# EasyEDA Pro project s3.eprj

# Schematic Schematic1
Board Name: Board1; Create Date: 2025-05-26; Page Name: P1; Project Name: s3; Schematic Name: Schematic1; Update Date: 2025-05-26; Company: 嘉立创EDA; Page Size: A4; Version: V1.0
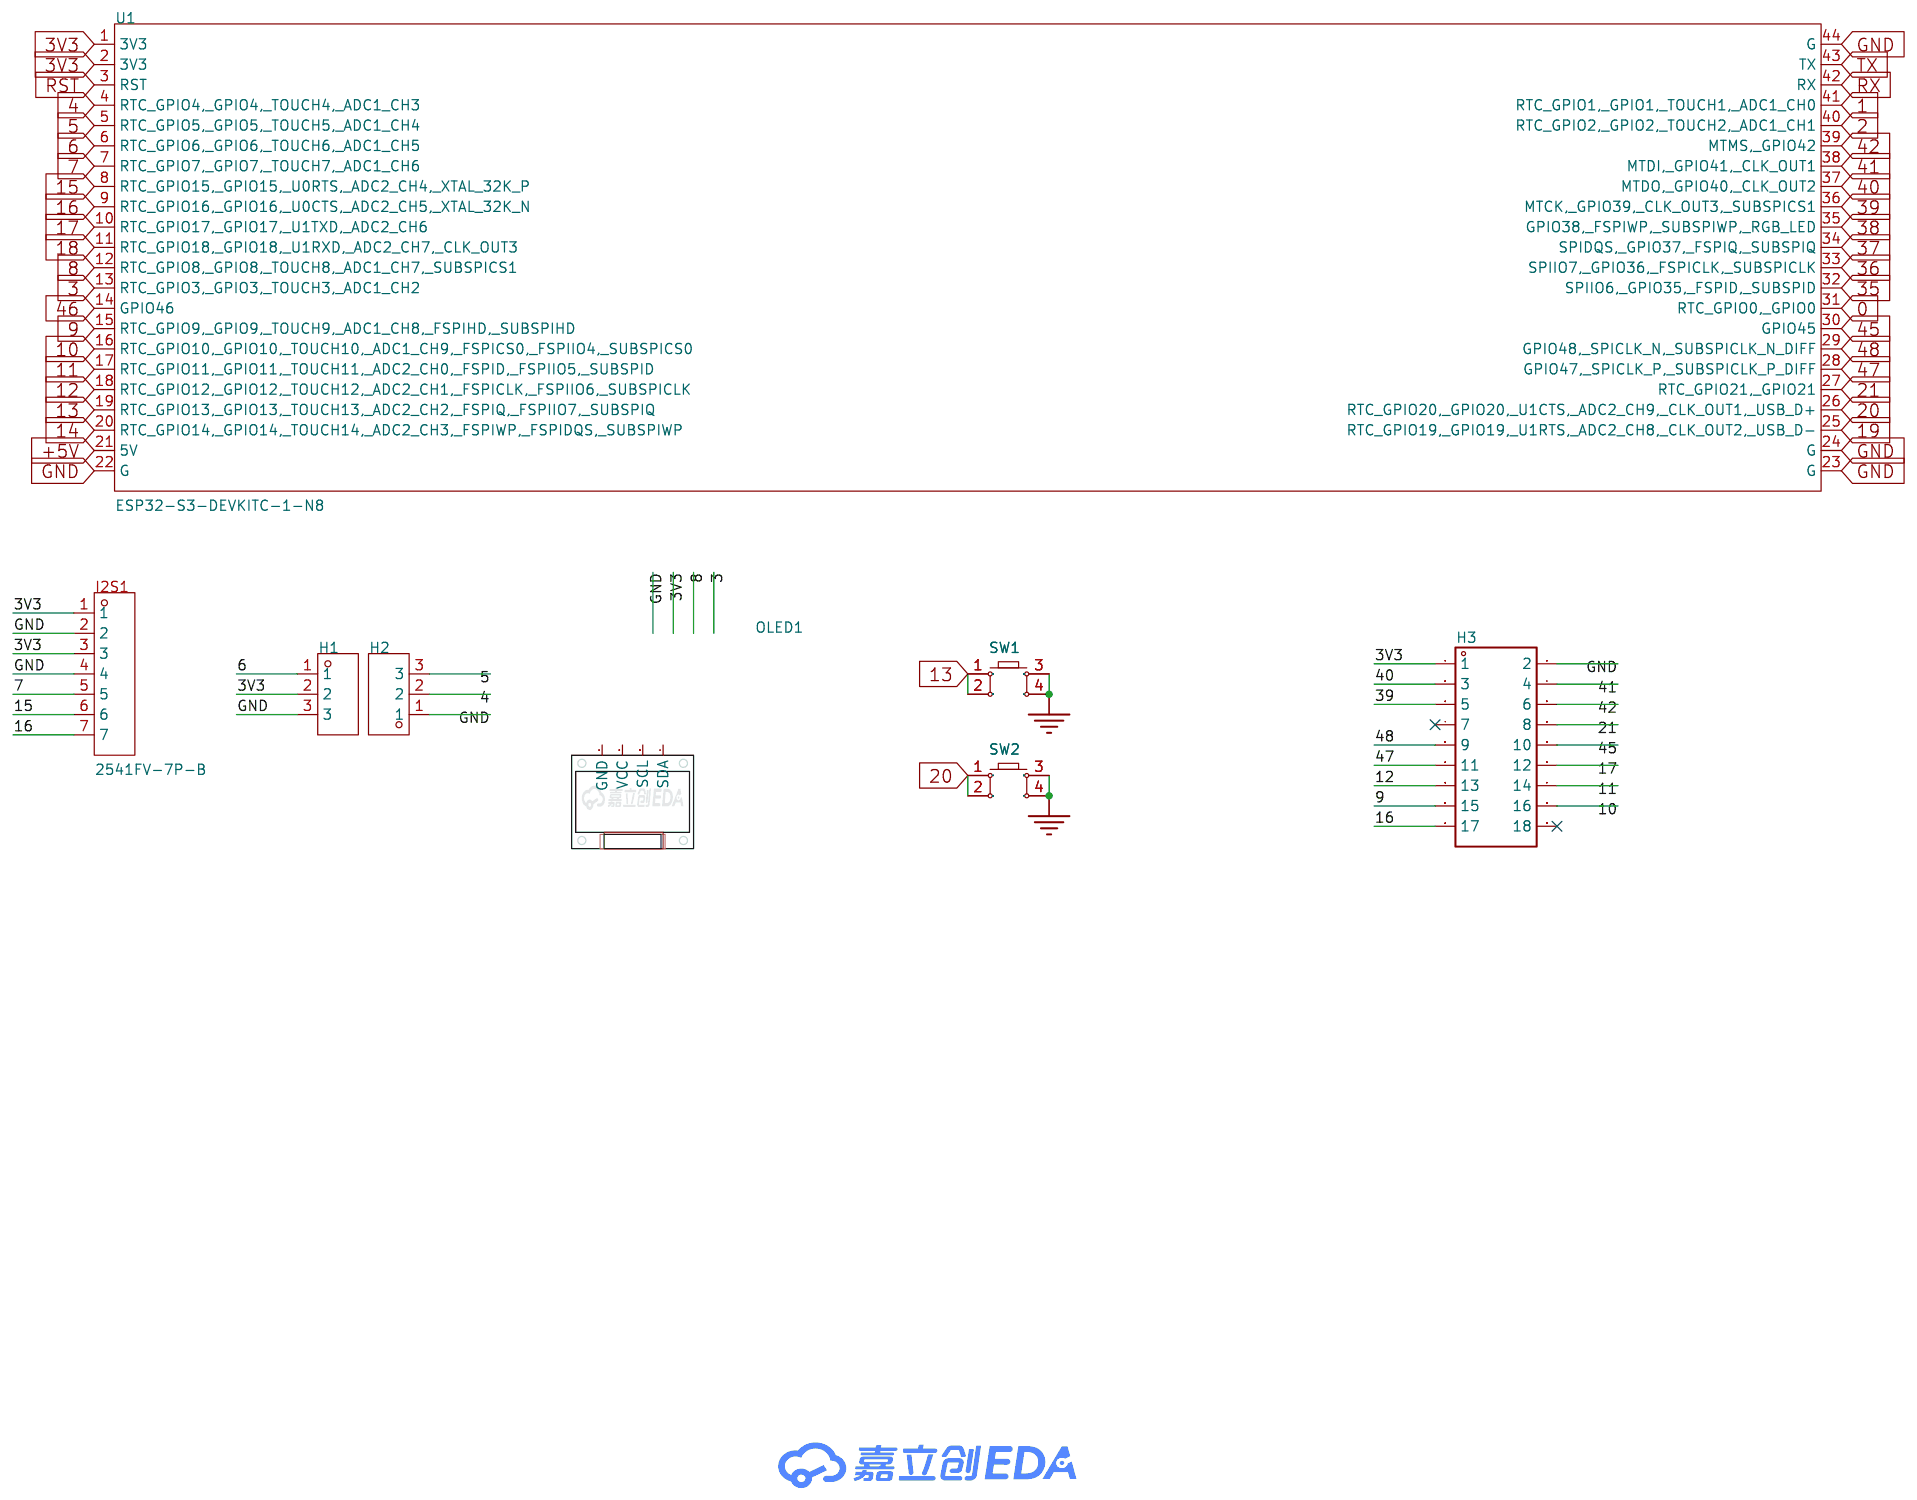
[diagram p0: schematic sheet]

## Parts
H1  -  [HDR-TH_3P-P2.54-V-F]
H2  -  [HDR-TH_3P-P2.54-V-F]
H3  -  [HDR-TH_18P-P2.54-V-F-R2-C9-S2.54-1]
I2S1  2541FV-7P-B  [HDR-TH_7P-P2.54-V-F]
OLED1  -  [0.96OLED_4P]
SW1  -  [SW-TH_4P-L6.0-W6.0-P4.50-LS6.5]
SW2  -  [SW-TH_4P-L6.0-W6.0-P4.50-LS6.5]
U1  ESP32-S3-DEVKITC-1-N8  [CONN-TH_ESP32-S3-DEVKITC-1U-N8]

## Library data of the parts
H1 H2 = HDR-F_2.54_1x3P: Supplier Part: C541850; Supplier Footprint: 插件
H3 = HDR-F_2.54_2x9: Supplier Part: C132125; Supplier Footprint: 插件
I2S1 = 2541FV-7P-B: 排母2.54mm单排 7P 直插方孔; Supplier Part: C25503116; Manufacturer: HanElectricity(瀚源); Supplier Footprint: 插件,P=2.54mm; JLCPCB Part Class: 扩展库; Datasheet: https://atta.szlcsc.com/upload/public/pdf/source/20240704/2CCE49895ED08C95E19327B953741130.pdf; Supplier: LCSC
OLED1 = 0.96OLED模块_4P: Supplier Footprint: 插件
SW1 SW2 = Key_TH_6x6x6: Supplier Part: C2837516; Supplier Footprint: 插件
U1 = ESP32-S3-DEVKITC-1-N8: Supplier Part: C20438410; Manufacturer: ESPRESSIF(乐鑫); JLCPCB Part Class: 扩展库; Supplier: LCSC

## Nets
3V3: H1.2 H3.1 I2S1.1 I2S1.3 U1.1(3V3) U1.2(3V3)
+5V: U1.21(5V)
GND: H1.3 H2.1 H3.2 I2S1.2 I2S1.4 SW1.3 SW1.4 SW2.3 SW2.4 U1.22(G) U1.23(G) U1.24(G) U1.44(G)
0: U1.31(RTC_GPIO0, GPIO0)
1: U1.41(RTC_GPIO1, GPIO1, TOUCH1, ADC1_CH0)
2: U1.40(RTC_GPIO2, GPIO2, TOUCH2, ADC1_CH1)
3: U1.13(RTC_GPIO3, GPIO3, TOUCH3, ADC1_CH2)
4: H2.2 U1.4(RTC_GPIO4, GPIO4, TOUCH4, ADC1_CH3)
5: H2.3 U1.5(RTC_GPIO5, GPIO5, TOUCH5, ADC1_CH4)
6: H1.1 U1.6(RTC_GPIO6, GPIO6, TOUCH6, ADC1_CH5)
7: I2S1.5 U1.7(RTC_GPIO7, GPIO7, TOUCH7, ADC1_CH6)
8: U1.12(RTC_GPIO8, GPIO8, TOUCH8, ADC1_CH7, SUBSPICS1)
9: H3.15 U1.15(RTC_GPIO9, GPIO9, TOUCH9, ADC1_CH8, FSPIHD, SUBSPIHD)
10: H3.16 U1.16(RTC_GPIO10, GPIO10, TOUCH10, ADC1_CH9, FSPICS0, FSPIIO4, SUBSPICS0)
11: H3.14 U1.17(RTC_GPIO11, GPIO11, TOUCH11, ADC2_CH0, FSPID, FSPIIO5, SUBSPID)
12: H3.13 U1.18(RTC_GPIO12, GPIO12, TOUCH12, ADC2_CH1, FSPICLK, FSPIIO6, SUBSPICLK)
13: SW1.1 SW1.2 U1.19(RTC_GPIO13, GPIO13, TOUCH13, ADC2_CH2, FSPIQ, FSPIIO7, SUBSPIQ)
14: U1.20(RTC_GPIO14, GPIO14, TOUCH14, ADC2_CH3, FSPIWP, FSPIDQS, SUBSPIWP)
15: I2S1.6 U1.8(RTC_GPIO15, GPIO15, U0RTS, ADC2_CH4, XTAL_32K_P)
16: H3.17 I2S1.7 U1.9(RTC_GPIO16, GPIO16, U0CTS, ADC2_CH5, XTAL_32K_N)
17: H3.12 U1.10(RTC_GPIO17, GPIO17, U1TXD, ADC2_CH6)
18: U1.11(RTC_GPIO18, GPIO18, U1RXD, ADC2_CH7, CLK_OUT3)
19: U1.25(RTC_GPIO19, GPIO19, U1RTS, ADC2_CH8, CLK_OUT2, USB_D-)
20: SW2.1 SW2.2 U1.26(RTC_GPIO20, GPIO20, U1CTS, ADC2_CH9, CLK_OUT1, USB_D+)
21: H3.8 U1.27(RTC_GPIO21, GPIO21)
35: U1.32(SPIIO6, GPIO35, FSPID, SUBSPID)
36: U1.33(SPIIO7, GPIO36, FSPICLK, SUBSPICLK)
37: U1.34(SPIDQS, GPIO37, FSPIQ, SUBSPIQ)
38: U1.35(GPIO38, FSPIWP, SUBSPIWP, RGB LED)
39: H3.5 U1.36(MTCK, GPIO39, CLK_OUT3, SUBSPICS1)
40: H3.3 U1.37(MTDO, GPIO40, CLK_OUT2)
41: H3.4 U1.38(MTDI, GPIO41, CLK_OUT1)
42: H3.6 U1.39(MTMS, GPIO42)
45: H3.10 U1.30(GPIO45)
46: U1.14(GPIO46)
47: H3.11 U1.28(GPIO47, SPICLK_P, SUBSPICLK_P_DIFF)
48: H3.9 U1.29(GPIO48, SPICLK_N, SUBSPICLK_N_DIFF)
RST: U1.3(RST)
RX: U1.42(RX)
TX: U1.43(TX)

Not connected (* = marked no-connect by the designer): H3 7* 18*; OLED1 1(GND) 2(VCC) 3(SCL) 4(SDA)

# Board PCB1
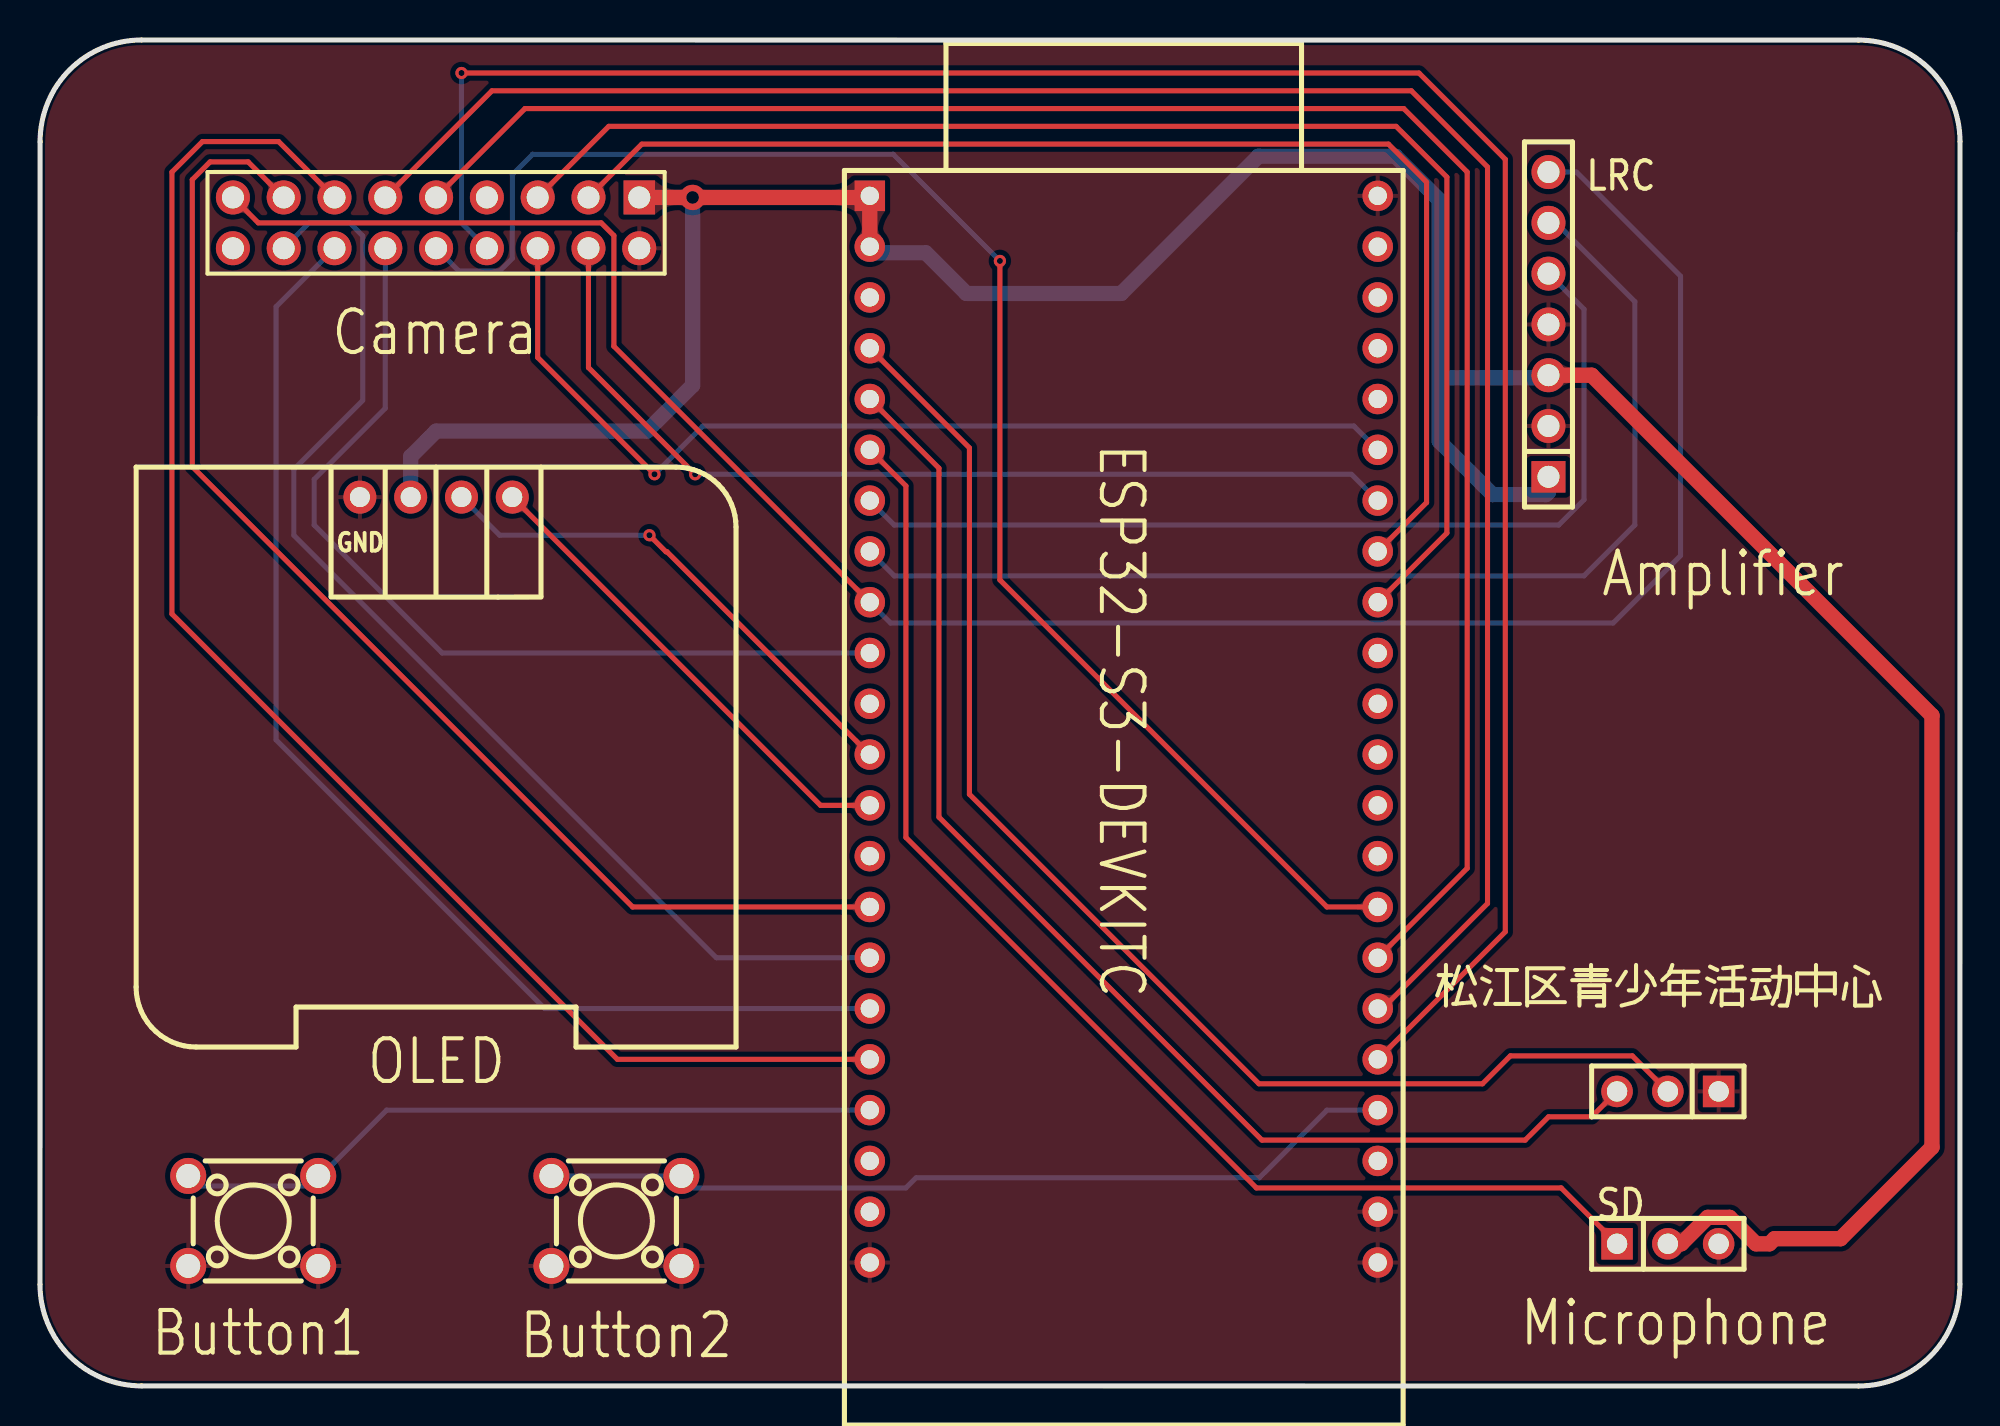
[diagram p1: board, top side]
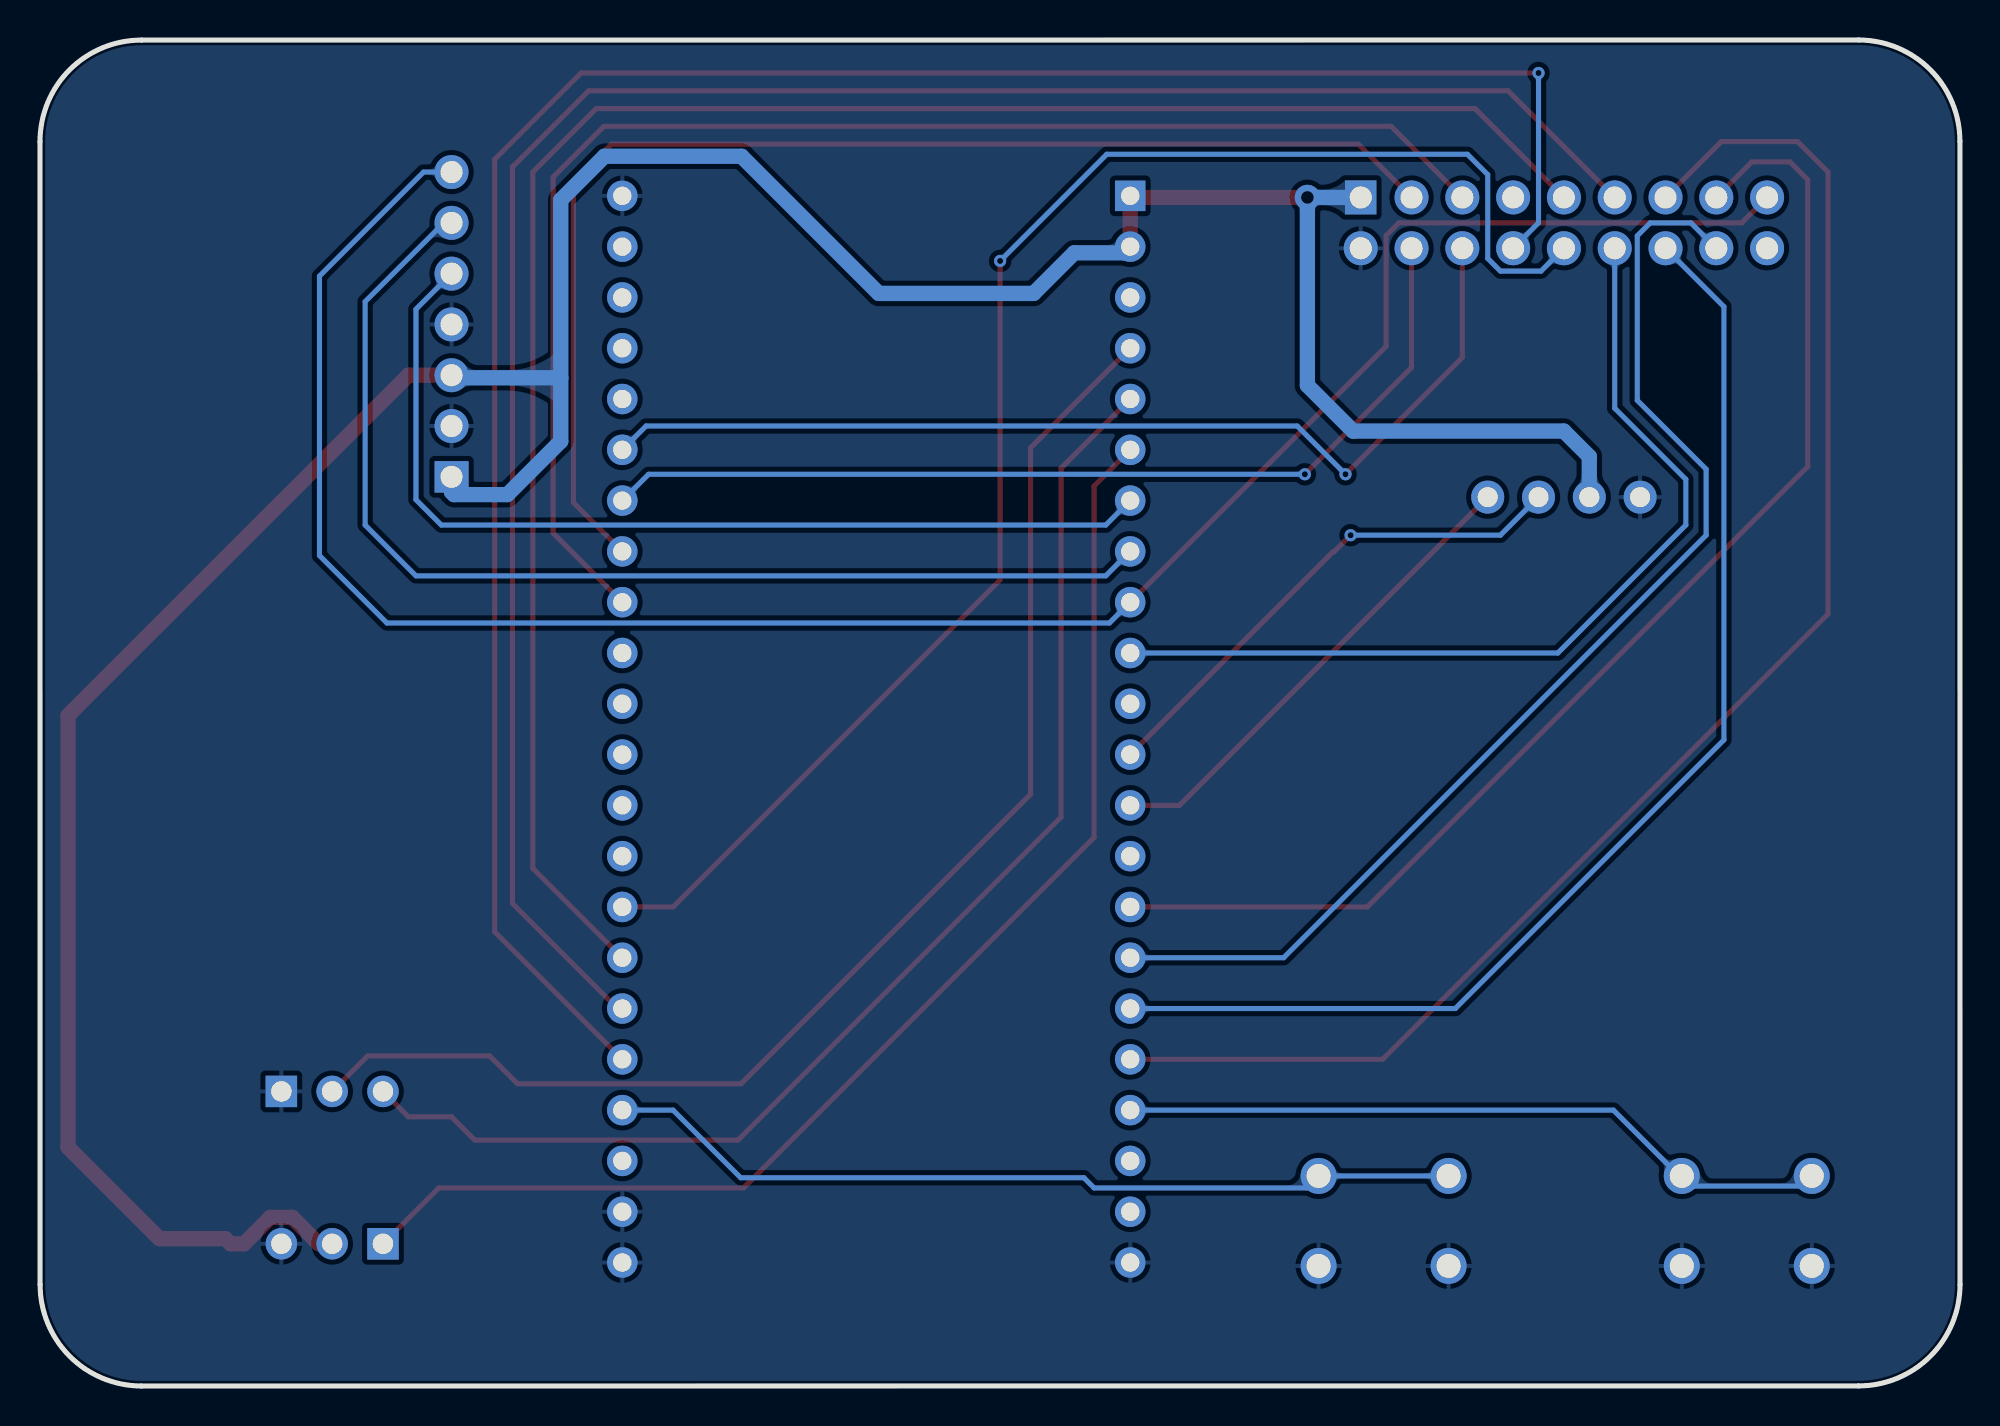
[diagram p2: board, bottom side, seen from below]

Outline 96.01 x 67.31 mm; copper layers: Top Layer, Bottom Layer. Coordinates in mm from the lower left corner of the outline.
Outline path: 0,62.23 0,5.07 arc(1.49,1.49) 5.08,0 90.94,0 arc(94.53,1.49) 96.01,5.08 96.01,62.23 arc(94.52,65.82) 90.93,67.3 5.07,67.31 arc(1.49,65.82) 0,62.23
Stack: Top Layer 0.035mm / Dielectric1 1.51mm FR4 er 4.5 / Bottom Layer 0.035mm

## Design rules (mm)
template: JLCPCB Capability(Two Layers Board)
spacing copperThickness1oz (default): track to track 0.102, other pairs 0.152 to 0.3
spacing copperThickness2oz: track to track 0.203, other pairs 0.152 to 0.3
track width copperThickness1oz (default): min 0.127, default 0.254, max 2.54
track width copperThickness2oz: min 0.203, default 0.254, max 2.54
differential pair differentialPair (default): width min 0.127, default 0.254, max 2.54; gap min 0.152, default 0.152
via viaSize (default): diameter min 0.5, default 0.61, max 10; hole min 0.3, default 0.305, max 6.3

## Placement (name value [footprint] x y rotation side)
H1  -  [HDR-TH_3P-P2.54-V-F]  81.4 7.11 0 top
H2  -  [HDR-TH_3P-P2.54-V-F]  81.4 14.73 180 top
H3  -  [HDR-TH_18P-P2.54-V-F-R2-C9-S2.54-1]  19.81 58.17 180 top
I2S1  2541FV-7P-B  [HDR-TH_7P-P2.54-V-F]  75.43 53.09 90 top
OLED1  -  [0.96OLED_4P]  19.81 44.45 0 top
SW1  -  [SW-TH_4P-L6.0-W6.0-P4.50-LS6.5]  10.66 8.25 0 top
SW2  -  [SW-TH_4P-L6.0-W6.0-P4.50-LS6.5]  28.82 8.25 0 top
U1  ESP32-S3-DEVKITC-1-N8  [CONN-TH_ESP32-S3-DEVKITC-1U-N8]  52.92 32.85 0 top

## Footprints (pads in the part's own frame, mm; a bottom-side part is the same pattern mirrored in y, then rotated)
0.96OLED_4P
  round 1.65 hole 1: 1(-3.81,-0.002) 2(-1.27,0.002) 3(1.27,0.002) 4(3.81,0.002)
CONN-TH_ESP32-S3-DEVKITC-1U-N8
  rect 1.524x1.524 hole 0.914: 1(-11.43,26.67)
  round 1.524 hole 0.914: 2(-11.43,24.13) 3(-11.43,21.59) 4(-11.43,19.05) 5(-11.43,16.51) 6(-11.43,13.97) 7(-11.43,11.43) 8(-11.43,8.89) 9(-11.43,6.35) 10(-11.43,3.81) 11(-11.43,1.27) 12(-11.43,-1.27) 13(-11.43,-3.81) 14(-11.43,-6.35) 15(-11.43,-8.89) 16(-11.43,-11.43) 17(-11.43,-13.97) 18(-11.43,-16.51) 19(-11.43,-19.05) 20(-11.43,-21.59) 21(-11.43,-24.13) 22(-11.43,-26.67) 23(13.97,-26.67) 24(13.97,-24.13) 25(13.97,-21.59) 26(13.97,-19.05) 27(13.97,-16.51) 28(13.97,-13.97) 29(13.97,-11.43) 30(13.97,-8.89) 31(13.97,-6.35) 32(13.97,-3.81) 33(13.97,-1.27) 34(13.97,1.27) 35(13.97,3.81) 36(13.97,6.35) 37(13.97,8.89) 38(13.97,11.43) 39(13.97,13.97) 40(13.97,16.51) 41(13.97,19.05) 42(13.97,21.59) 43(13.97,24.13) 44(13.97,26.67)
HDR-TH_3P-P2.54-V-F
  rect 1.575x1.575 hole 1.02: 1(-2.54,0)
  round 1.575 hole 1.02: 2(0,0) 3(2.54,0)
HDR-TH_7P-P2.54-V-F
  rect 1.575x1.7 hole 1.1: 1(-7.62,0)
  round 1.7 hole 1.1: 2(-5.08,0) 3(-2.54,0) 4(0,0) 5(2.54,0) 6(5.08,0) 7(7.62,0)
HDR-TH_18P-P2.54-V-F-R2-C9-S2.54-1
  rect 1.575x1.7 hole 1.1: 1(-10.16,-1.27)
  round 1.7 hole 1.1: 2(-10.16,1.27) 3(-7.62,-1.27) 4(-7.62,1.27) 5(-5.08,-1.27) 6(-5.08,1.27) 7(-2.54,-1.27) 8(-2.54,1.27) 9(0,-1.27) 10(0,1.27) 11(2.54,-1.27) 12(2.54,1.27) 13(5.08,-1.27) 14(5.08,1.27) 15(7.62,-1.27) 16(7.62,1.27) 17(10.16,-1.27) 18(10.16,1.27)
SW-TH_4P-L6.0-W6.0-P4.50-LS6.5
  round 1.8 hole 1.2: 1(-3.25,2.25) 2(3.25,2.25) 3(-3.25,-2.25) 4(3.25,-2.25)

## Nets
As in the schematic, except:
3V3: H1.2 H3.1 I2S1.1 I2S1.3 OLED1.2 U1.1 U1.2
GND: H1.3 H2.1 H3.2 I2S1.2 I2S1.4 OLED1.1 SW1.3 SW1.4 SW2.3 SW2.4 U1.22 U1.23 U1.24 U1.44
3: OLED1.4 U1.13
8: OLED1.3 U1.12

Pads without a net: H3 7 18

## Via types
v1: diameter 1.27, hole 0.635, Top Layer to Bottom Layer, 1 via
v2: diameter 0.61, hole 0.305, Top Layer to Bottom Layer, 5 vias

## Routing (per net, layer and track width the routed paths; a pad name or vN(x,y) marks a point on that pad's centre or on a via; arc(x,y) is an arc through that point)
3V3: length 166
  Top Layer w0.762: I2S1.3 77.59,50.55 94.61,33.53 94.61,11.94 90.04,7.37 86.74,7.37 86.48,7.11 85.81,7.11 84.49,8.43 83.39,8.43 82.07,7.11 H1.2 ; U1.2 U1.1 41.41,59.44 v1(32.63,59.44) H3.1
  Bottom Layer w0.762: 69.97,50.42 69.97,59.31 67.79,61.49 60.93,61.49 54.07,54.64 46.32,54.64 44.29,56.67 41.8,56.67 U1.2 ; 69.97,50.42 69.97,47.24 72.64,44.58 75.31,44.58 75.43,44.7 I2S1.1 ; 69.97,50.42 75.31,50.42 I2S1.3 ; OLED1.2 18.54,46.48 19.81,47.75 30.35,47.75 32.63,50.04 v1(32.63,59.44) H3.1
3: length 24.3
  Top Layer w0.254: U1.13 39.03,29.04 OLED1.4
4: length 66.6
  Top Layer w0.254: U1.4 46.48,46.91 46.48,29.59 60.95,15.11 72.13,15.11 73.53,16.51 79.62,16.51 H2.2
5: length 63.9
  Top Layer w0.254: U1.5 44.95,45.9 44.95,28.45 61.1,12.3 74.27,12.3 75.43,13.46 77.59,13.46 78.86,14.73
6: length 64.1
  Top Layer w0.254: U1.6 43.3,45.01 43.3,27.43 60.83,9.91 76.07,9.91 78.86,7.11
7: length 48.8
  Bottom Layer w0.254: U1.7 42.72,43.05 75.94,43.05 77.21,44.32 77.21,53.85 I2S1.5
8: length 25.8
  Top Layer w0.254: U1.12 31.35,41.72 31.3,41.72 v2(30.47,42.54)
  Bottom Layer w0.254: v2(30.47,42.54) 22.98,42.54 OLED1.3
9: length 63
  Top Layer w0.254: H3.15 10.41,61.21 8.5,61.21 7.61,60.32 7.61,45.97 29.63,23.96 U1.15
10: length 58.7
  Bottom Layer w0.254: U1.16 33.82,21.42 12.69,42.54 12.69,45.85 16.14,49.29 16.14,57.52 15.49,58.17 13.46,58.17 H3.16
11: length 61
  Bottom Layer w0.254: U1.17 25.24,18.88 11.81,32.31 11.81,53.97 H3.14
12: length 76.1
  Top Layer w0.254: H3.13 11.93,62.23 8.12,62.23 6.6,60.71 6.6,38.61 28.87,16.34 U1.18
13: length 35.9
  Bottom Layer w0.254: U1.19 17.33,13.8 13.53,10 7.92,10 SW1.1
15: length 56.9
  Bottom Layer w0.254: U1.8 42.72,40.51 77.21,40.51 79.75,43.05 79.75,54.23 75.81,58.17 I2S1.6
16: length 108.6
  Top Layer w0.254: U1.9 28.7,51.99 28.7,57.53 28.06,58.17 10.92,58.17 H3.17
  Bottom Layer w0.254: U1.9 42.54,38.15 78.66,38.15 82.04,41.53 82.04,55.5 76.83,60.71 I2S1.7
17: length 45.7
  Bottom Layer w0.254: U1.10 20.11,36.66 13.71,43.05 13.71,45.34 17.27,48.89 H3.12
20: length 43.2
  Bottom Layer w0.254: SW2.1 SW2.2 32.67,9.91 43.3,9.91 43.81,10.41 60.97,10.41 64.35,13.8 U1.26
21: length 110.9
  Top Layer w0.254: v2(21.08,65.66) 68.96,65.66 73.27,61.34 73.27,22.72 U1.27
  Bottom Layer w0.254: v2(21.08,65.66) 21.08,58.17 H3.8
39: length 70.7
  Top Layer w0.254: H3.5 28.44,62.99 67.81,62.99 70.35,60.45 70.35,42.65 U1.36
40: length 63.3
  Top Layer w0.254: U1.37 69.34,44.18 69.34,60.2 67.43,62.1 30.09,62.1 H3.3
41: length 48.2
  Top Layer w0.254: v2(32.76,45.59) 27.43,50.93 H3.4
  Bottom Layer w0.254: v2(32.76,45.59) 65.58,45.59 U1.38
42: length 51.4
  Top Layer w0.254: v2(30.73,45.59) 24.89,51.43 H3.6
  Bottom Layer w0.254: U1.39 65.7,48.01 33.14,48.01 v2(30.73,45.59)
45: length 77.4
  Top Layer w0.254: v2(48,56.26) 48,40.31 64.35,23.96 U1.30
  Bottom Layer w0.254: v2(48,56.26) 42.67,61.59 24.63,61.59 23.62,60.58 23.62,56.39 22.98,55.75 20.95,55.75 H3.10
47: length 103.4
  Top Layer w0.254: H3.11 22.6,64.77 68.58,64.77 72.39,60.96 72.39,24.13 67.13,18.88 U1.28
48: length 95.9
  Top Layer w0.254: U1.29 71.37,25.89 71.37,60.71 68.19,63.88 24.25,63.88 H3.9

## Copper pours and planes (outline as drawn; the poured copper is in the pictures)
GND on Top Layer: -0.01,67.31 96.01,67.31 96.01,0 -0.01,0
GND on Bottom Layer: -0.01,67.31 96.01,67.31 96.01,0 -0.01,0

Small or netless copper shapes (teardrops, artwork), in the pictures only: 40 on Top Layer, 37 on Bottom Layer

## Text on the board
Top Silkscreen Layer: GND | LRC | SD | Camera | OLED | Microphone | ESP32-S3-DEVKITC | Button1 | Button2 | Amplifier | 松江区青少年活动中心
